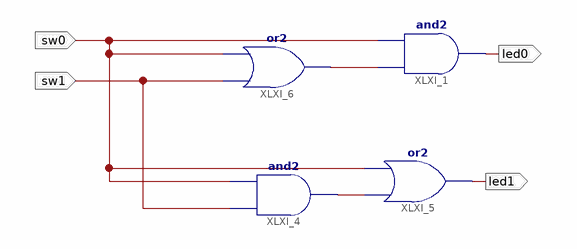
[diagram p0: schematic sheet 1]
// Xilinx ISE schematic tema_1c.sch (spartan3e) as structural Verilog: 4 symbols, 4 ports
module tema_1c (
  input  sw0,
  input  sw1,
  output led0,
  output led1
);

  wire XLXN_1, XLXN_2;

  and XLXI_1 (led0, XLXN_1, sw0);
  or XLXI_6 (XLXN_1, sw1, sw0);
  and XLXI_4 (XLXN_2, sw1, sw0);
  or XLXI_5 (led1, XLXN_2, sw0);
endmodule
